# EAGLE design usbledv2 (EAGLE 5.06)
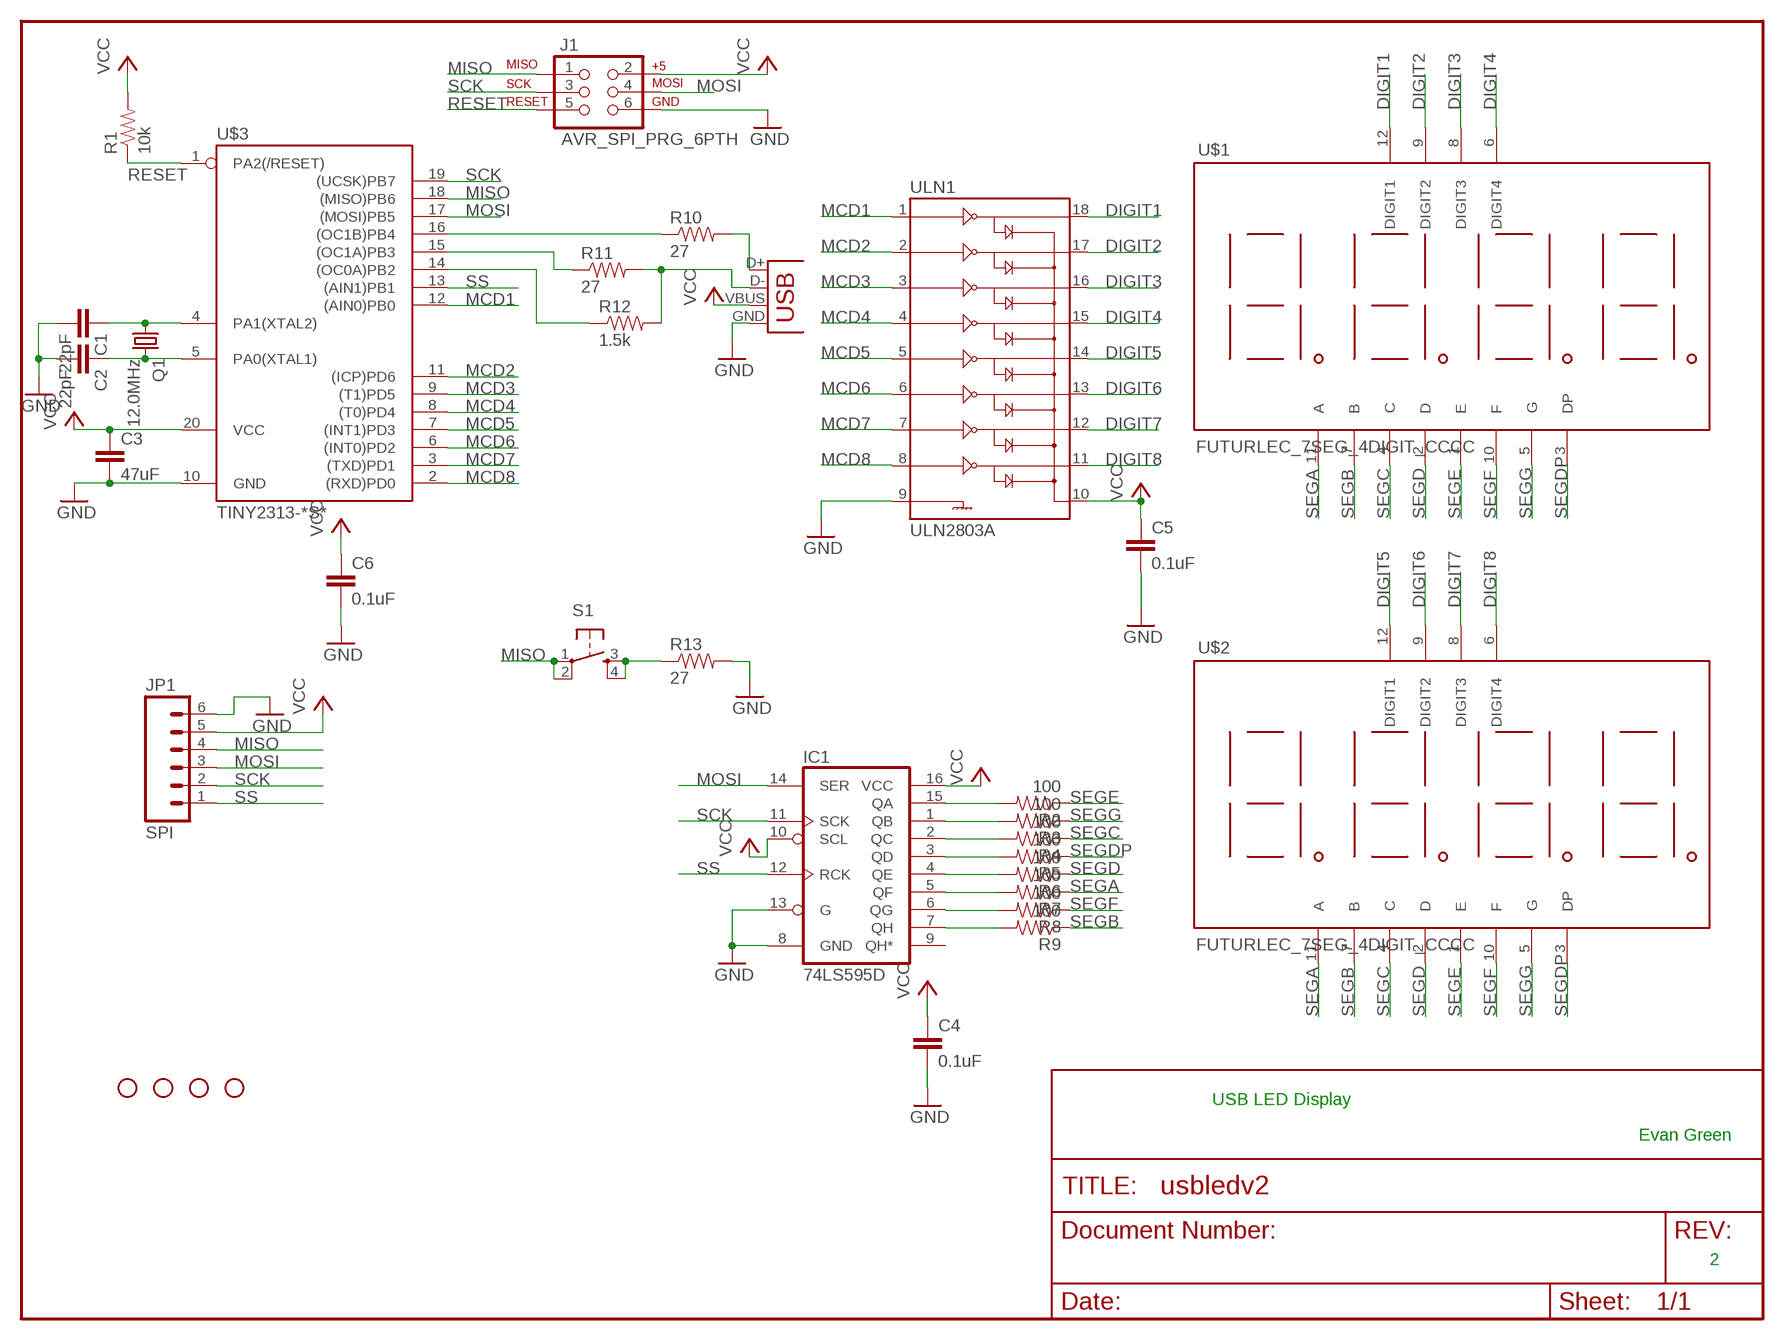
[diagram p0: schematic, sheet 1]

## Parts
C1  22pF  CAP0402-CAP  [0402-CAP]
C2  22pF  CAP0402-CAP  [0402-CAP]
C3  47uF  CAP1210  [1210]
C4  0.1uF  CAP0402-CAP  [0402-CAP]
C5  0.1uF  CAP0402-CAP  [0402-CAP]
C6  0.1uF  CAP0402-CAP  [0402-CAP]
IC1  74LS595D  [SO16]
J1  AVR_SPI_PRG_6PTH  [2X3]
JP1  SPI  M06SIP  [1X06]
JP2  STAND-OFF  [STAND-OFF]
JP3  STAND-OFF  [STAND-OFF]
JP4  STAND-OFF  [STAND-OFF]
JP5  STAND-OFF  [STAND-OFF]
Q1  12.0MHz  CRYSTALTC38H  [TC38H]
R1  10k  RESISTOR0402-RES  [0402-RES]
R2  100  RESISTOR0402-RES  [0402-RES]
R3  100  RESISTOR0402-RES  [0402-RES]
R4  100  RESISTOR0402-RES  [0402-RES]
R5  100  RESISTOR0402-RES  [0402-RES]
R6  100  RESISTOR0402-RES  [0402-RES]
R7  100  RESISTOR0402-RES  [0402-RES]
R8  100  RESISTOR0402-RES  [0402-RES]
R9  100  RESISTOR0402-RES  [0402-RES]
R10  27  RESISTOR0402-RES  [0402-RES]
R11  27  RESISTOR0402-RES  [0402-RES]
R12  1.5k  RESISTOR0402-RES  [0402-RES]
R13  27  RESISTOR0402-RES  [0402-RES]
S1  TAC_SWITCHSMD  [TACTILE_SWITCH_SMD]
U$1  FUTURLEC_7SEG_4DIGIT_CCCC  [FUTURLEC_7SEG_4DIGIT_CC]
U$2  FUTURLEC_7SEG_4DIGIT_CCCC  [FUTURLEC_7SEG_4DIGIT_CC]
U$3  TINY2313-*S*  [SO20L$]
ULN1  ULN2803A  ULN2803SOICW  [SO18L]
X1  USBSMD  [USB-MINIB]

## Nets
DIGIT1: U$1.12(DIGIT1) ULN1.18
DIGIT2: U$1.9(DIGIT2) ULN1.17
DIGIT3: U$1.8(DIGIT3) ULN1.16
DIGIT4: U$1.6(DIGIT4) ULN1.15
DIGIT5: U$2.12(DIGIT1) ULN1.14
DIGIT6: U$2.9(DIGIT2) ULN1.13
DIGIT7: U$2.8(DIGIT3) ULN1.12
DIGIT8: U$2.6(DIGIT4) ULN1.11
GND: C1.2 C2.2 C3.2 C4.2 C5.2 C6.2 IC1.8(GND) IC1.13(G) J1.6 JP1.6 R13.2 U$3.10(GND) ULN1.9 X1.GND
MCD1: U$3.12((AIN0)PB0) ULN1.1
MCD2: U$3.11((ICP)PD6) ULN1.2
MCD3: U$3.9((T1)PD5) ULN1.3
MCD4: U$3.8((T0)PD4) ULN1.4
MCD5: U$3.7((INT1)PD3) ULN1.5
MCD6: U$3.6((INT0)PD2) ULN1.6
MCD7: U$3.3((TXD)PD1) ULN1.7
MCD8: U$3.2((RXD)PD0) ULN1.8
MISO: J1.1 JP1.4 S1.1 S1.2 U$3.18((MISO)PB6)
MOSI: IC1.14(SER) J1.4 JP1.3 U$3.17((MOSI)PB5)
N$1: R11.1 U$3.15((OC1A)PB3)
N$2: C1.1 Q1.1 U$3.4(PA1(XTAL2))
N$3: C2.1 Q1.2 U$3.5(PA0(XTAL1))
N$4: R12.1 U$3.14((OC0A)PB2)
N$5: R13.1 S1.3 S1.4
N$11: R10.2 X1.D+
N$12: R10.1 U$3.16((OC1B)PB4)
N$13: R11.2 R12.2 X1.D-
N$32: IC1.15(QA) R2.2
N$33: IC1.1(QB) R3.2
N$34: IC1.2(QC) R4.2
N$35: IC1.3(QD) R5.2
N$36: IC1.4(QE) R6.2
N$37: IC1.5(QF) R7.2
N$38: IC1.6(QG) R8.2
N$39: IC1.7(QH) R9.2
RESET: J1.5 R1.1 U$3.1(PA2(/RESET))
SCK: IC1.11(SCK) J1.3 JP1.2 U$3.19((UCSK)PB7)
SEGA: R7.1 U$1.11(A) U$2.11(A)
SEGB: R9.1 U$1.7(B) U$2.7(B)
SEGC: R4.1 U$1.4(C) U$2.4(C)
SEGD: R6.1 U$1.2(D) U$2.2(D)
SEGDP: R5.1 U$1.3(DP) U$2.3(DP)
SEGE: R2.1 U$1.1(E) U$2.1(E)
SEGF: R8.1 U$1.10(F) U$2.10(F)
SEGG: R3.1 U$1.5(G) U$2.5(G)
SS: IC1.12(RCK) JP1.1 U$3.13((AIN1)PB1)
VCC: C3.1 C4.1 C5.1 C6.1 IC1.10(SCL) IC1.16(VCC) J1.2 JP1.5 R1.2 U$3.20(VCC) ULN1.10 X1.VBUS
Unconnected: IC1.9(QH*)

## Notes on the sheet
- USB LED Display
- Evan Green
- 2

## Library data of the parts
C1-C6 = SparkFun:CAP: Capacitor Standard 0603 ceramic capacitor, and 0.1" leaded capacitor.
IC1 = SparkFun:74*595: 8-bit SHIFT REGISTER, output latch
J1 = SparkFun:AVR_SPI_PRG_6: AVR ISP 6 Pin This is the reduced ISP connector for AVR programming. Common on Arduino. This footprint will take up less PCB space and can be used with a 10-pin to 6-pin adapter such as SKU: BOB-08508
JP1 = SparkFun:M06: Header 6 Standard 6-pin 0.1" header. Use with straight break away headers (SKU : PRT-00116), right angle break away headers (PRT-00553), swiss pins (PRT-00743), machine pins (PRT-00117), and female headers (PRT-00115). Molex polarized connector foot print use with SKU : PRT-08094 with associated crimp pins and housings. NOTES ON THE VARIANTS LOCK and LOCK_LONGPADS... This footprint was designed to help hold the alignment of a through-hole component (i.e. 6-pin header) while soldering it into place. You may notice that each hole has been shifted either up or down by 0.005 of an inch from it's more standard position (which is a perfectly straight line). This slight alteration caused the pins (the squares in the middle) to touch the edges of the holes. Because they are alternating, it causes a "brace" to hold the component in place. 0.005 has proven to be the perfect amount of "off-center" position when using our standard breakaway headers. Although looks a little odd when you look at the bare footprint, once you have a header in there, the alteration is very hard to notice. Also, if you push a header all the way into place, it is covered up entirely on the bottom side. This idea of altering the position of holes to aid alignment will be further integrated into the Sparkfun Library for other footprints. It can help hold any component with 3 or more connection pins.
JP2-JP5 = SparkFun:STAND-OFF: Stand Off This is the mechanical footprint for a #4 phillips button head screw. Use the keepout ring to avoid running the screw head into surrounding components. SKU : PRT-00447
Q1 = SparkFun:CRYSTAL: Crystals Various standard crystals. Proven footprints. Spark Fun Electronics SKU : COM-00534
R1-R13 = SparkFun:RESISTOR: Resistor Basic schematic elements and footprints for 0603, 1206, and PTH 1/10th watt (small) resistors.
S1 = SparkFun:TAC_SWITCH: Momentary Switch Button commonly used for reset or general input. Spark Fun Electronics SKU : COM-00097
U$1 U$2 = Evan:FUTURLEC_7SEG_4DIGIT_CC: 4-Digit 7-Segment LED Display from Futurlec: 7FR5641AS, 7FG5641AG, 7FY5641AY, 7FB5641AB, 7FW5641AW.
U$3 = avr-6:TINY2313*: Atmel Tiny2313 2K Flash, 128 bytes EEPROM, 128 bytes RAM
ULN1 = SparkFun:ULN2803: Darlington Driver ULN2803 Darlington array. 500mA max per channel, 8-channel package. Spark Fun Electronics SKU : COM-00312
X1 = SparkFun:USB: USB Connectors USB-B-PTH is fully proven SKU : PRT-00139 USB-miniB is fully proven SKU : PRT-00587 USB-A-PCB is untested. USB-A-H is throughly reviewed, but untested. Spark Fun Electronics SKU : PRT-00437 USB-B-SMT is throughly reviewed, but untested. Needs silkscreen touching up. USB-A-S has not been used/tested USB-MB-H has not been used/tested

## Net classes
0 default: width 0.406 mm

## Board
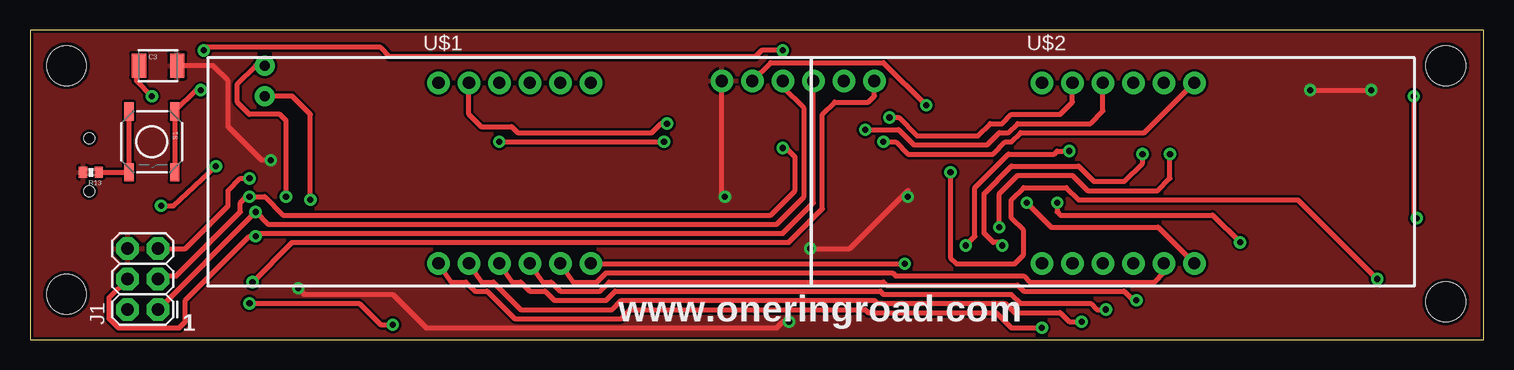
[diagram p1: board, top side]
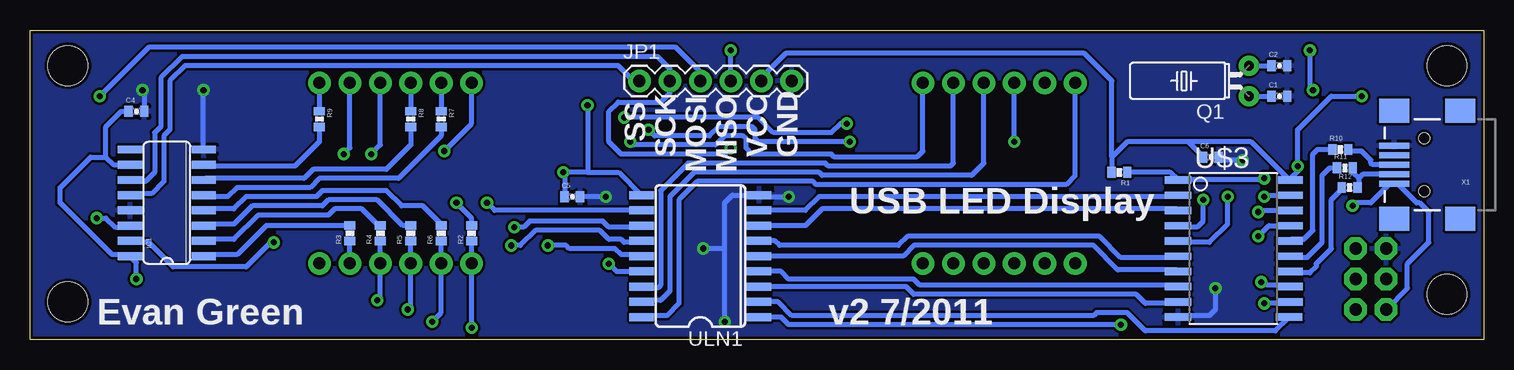
[diagram p2: board, bottom side, seen from below]

Size 121.14 x 25.83 mm. Coordinates in mm from the lower left corner, seen from the top.
Outline: 0,0 121.14,0 121.14,25.83 0,25.83 0,0
Copper layers (1*16): Top 0.035mm / dielectric 1.5mm / Bottom 0.035mm
Design rules "SparkFun": minimum track width 8mil, minimum drill 20mil, track to track 8mil, track to pad 8mil, pad to pad 8mil, via to via 8mil, smd to smd 8mil, copper to edge 10mil, drill to drill 8mil, minimum pad ring 12mil, minimum via ring 10mil, stop-mask expansion 4mil, vias tented up to drill 25mil, thermal gap 10mil

### Footprints (pad centres in the part's own frame; a part is rotated, then mirrored left to right if it is on the bottom)
0402-CAP = smd 0.7 x 0.9: 1 -0.65,0; 2 0.65,0
1210 = smd 1.2 x 2: 1 -1.6,0; 2 1.6,0
SO16 = smd 0.66 x 2.032: 1 -4.445,-3.073; 2 -3.175,-3.073; 3 -1.905,-3.073; 4 -0.635,-3.073; 5 0.635,-3.073; 6 1.905,-3.073; 7 3.175,-3.073; 8 4.445,-3.073; 9 4.445,3.073; 10 3.175,3.073; 11 1.905,3.073; 12 0.635,3.073; 13 -0.635,3.073; 14 -1.905,3.073; 15 -3.175,3.073; 16 -4.445,3.073
2X3 = drill 1.016 pad 1.88 octagon: 1 0,0; 2 0,2.54; 3 2.54,0; 4 2.54,2.54; 5 5.08,0; 6 5.08,2.54
1X06 = drill 1.016 pad 1.88 round: 1 0,0; 2 2.54,0; 3 5.08,0; 4 7.62,0; 5 10.16,0; 6 12.7,0
STAND-OFF = hole 3.302: 0,0
TC38H = drill 0.813 pad 1.676 round: 1 -1.27,0; 2 1.27,0
0402-RES = smd 0.7 x 0.9: 1 -0.65,0; 2 0.65,0
TACTILE_SWITCH_SMD = smd 1.524 x 0.762: 1 -2.54,1.905; 2 2.54,1.905; 3 -2.54,-1.905; 4 2.54,-1.905
FUTURLEC_7SEG_4DIGIT_CC = drill 1.016 pad 1.88 round: 1 -6.35,-7.58; 2 -3.81,-7.58; 3 -1.27,-7.58; 4 1.27,-7.58; 5 3.81,-7.58; 6 6.35,-7.58; 7 6.35,7.46; 8 3.81,7.46; 9 1.27,7.46; 10 -1.27,7.46; 11 -3.81,7.46; 12 -6.35,7.46
SO20L$ = smd 0.61 x 2.21: 1 -5.715,-4.636; 2 -4.445,-4.636; 3 -3.175,-4.636; 4 -1.905,-4.636; 5 -0.635,-4.636; 6 0.635,-4.636; 7 1.905,-4.636; 8 3.175,-4.636; 9 4.445,-4.636; 10 5.715,-4.636; 11 5.715,4.61; 12 4.445,4.636; 13 3.175,4.636; 14 1.905,4.636; 15 0.635,4.636; 16 -0.635,4.636; 17 -1.905,4.636; 18 -3.175,4.636; 19 -4.445,4.636; 20 -5.715,4.636
SO18L = smd 0.66 x 2.032: 1 -0.635,-4.902; 2 0.635,-4.902; 3 1.905,-4.902; 4 3.175,-4.902; 5 4.445,-4.902; 6 5.715,-4.902; 7 6.985,-4.902; 8 8.255,-4.902; 9 9.525,-4.902; 10 9.525,4.902; 11 8.255,4.902; 12 6.985,4.902; 13 5.715,4.902; 14 4.445,4.902; 15 3.175,4.902; 16 1.905,4.902; 17 0.635,4.902; 18 -0.635,4.902
USB-MINIB = smd 2.5 x 0.5: D+ 2.5,0; D- 2.5,0.8; GND 2.5,-1.6; ID 2.5,-0.8; VBUS 2.5,1.6 | smd 2.5 x 2: GND@1 -3,-4.5; GND@2 -3,4.5; GND@3 2.5,4.5; GND@4 2.5,-4.5 | hole 0.9: 0,2.2; 0,-2.2

### Placement (x,y rotation side)
C1  17.02,20.32 0 bottom
C2  17.02,22.86 0 bottom
C3  10.67,22.86 0 top
C4  112.27,19.05 0 bottom
C5  75.95,11.94 0 bottom
C6  22.73,15.24 0 bottom
IC1  109.73,11.43 90 bottom
J1  10.67,2.54 90 top
JP1  70.36,21.59 0 bottom
JP2  3.05,22.86 0 top
JP3  3.05,3.81 0 top
JP4  117.98,22.86 0 top
JP5  117.98,3.17 0 top
Q1  19.56,21.59 90 bottom
R1  30.35,13.97 180 bottom
R2  84.33,8.89 90 bottom
R3  94.49,8.89 90 bottom
R4  91.95,8.89 90 bottom
R5  89.41,8.89 90 bottom
R6  86.87,8.89 90 bottom
R7  86.87,18.41 270 bottom
R8  89.41,18.41 270 bottom
R9  97.03,18.41 270 bottom
R10  11.94,15.88 0 bottom
R11  11.56,14.35 0 bottom
R12  11.18,12.7 0 bottom
R13  5.08,13.97 180 top
S1  10.16,16.51 270 top
U$1  40.39,13.97 0 top
U$2  90.68,13.97 0 top
U$3  20.83,7.62 270 bottom
ULN1  65.28,2.54 90 bottom
X1  4.95,14.61 180 bottom

### Tracks (layer width: path | path; a pad name or v marks a point on that pad's centre or on a via)
DIGIT1
  Bottom 0.406: ULN1.18 70.05,2.03 68.07,2.03 67.06,3.05 67.06,11.68 65.53,13.21 55.88,13.21 55.63,12.95 34.8,12.95 34.04,13.72 U$1.12
DIGIT2
  Bottom 0.406: ULN1.17 70.05,3.3 68.58,3.3 67.82,4.06 67.82,11.94 65.79,13.97 55.37,13.97 55.12,13.72 42.67,13.72 41.66,14.73 U$1.9
DIGIT3
  Bottom 0.406: ULN1.16 70.05,4.32 68.83,4.32 68.58,4.57 68.58,12.45 66.29,14.73 54.86,14.73 54.61,14.48 44.45,14.48 44.2,14.73 U$1.8
DIGIT4  (via drill 0.51)
  Top 0.406: U$1.6 46.27,6.35 v72.9,6.35
  Bottom 0.406: v72.9,6.35 72.26,5.71 ULN1.15
DIGIT5  (via drill 0.51)
  Top 0.406: v77.98,7.87 78.74,8.64 78.74,12.7 81.53,15.49 85.34,15.49 85.6,15.75 v86.61,15.75
  Bottom 0.406: ULN1.14 70.31,7.11 71.88,7.11 72.39,7.62 76.2,7.62 76.45,7.87 v77.98,7.87 | v86.61,15.75 84.33,18.03 U$2.12
DIGIT6  (via drill 0.51)
  Top 0.406: v81.03,7.87 80.77,8.13 80.26,8.13 79.5,8.89 79.5,12.19 81.79,14.48 87.38,14.48 88.65,13.21 91.19,13.21 92.71,14.73 v92.71,15.49
  Bottom 0.406: ULN1.13 70.31,8.13 71.63,8.13 71.88,8.38 72.9,8.38 73.66,9.14 78.99,9.14 80.26,7.87 v81.03,7.87 | v92.71,15.49 91.95,16.26 U$2.9
DIGIT7  (via drill 0.51)
  Top 0.406: v80.77,9.4 80.77,12.19 82.3,13.72 86.87,13.72 88.14,12.45 93.98,12.45 95,13.46 v95,15.49
  Bottom 0.406: ULN1.12 70.31,9.4 72.9,9.4 73.41,9.91 79.5,9.91 80.01,9.4 v80.77,9.4 | v95,15.49 94.49,16 U$2.8
DIGIT8  (via drill 0.51)
  Top 0.406: U$2.6 94.02,9.4 85.09,9.4 v83.06,11.43
  Bottom 0.406: v83.06,11.43 82.42,10.79 ULN1.11
GND  (via drill 0.51)
  Top 0.406: C3.2 12.27,22.78 12.34,22.86 15.24,22.86 16.51,21.59 16.51,17.78 19.3,14.99 v20.07,14.99 | v57.91,11.94 57.66,12.19 JP1.6 | v73.15,11.94 73.15,12.45 68.33,7.62 v65.02,7.62 | v106.68,20.83 v111.76,20.83 | v22.35,4.32 22.86,3.81 30.23,3.81 33.02,1.02 62.23,1.02 62.74,1.52 v63.25,1.52
  Bottom 0.406: C6.2 21.83,14.99 v20.07,14.99 | v57.91,11.94 60.25,11.94 ULN1.9 62.61,12.06 63.25,11.43 63.25,7.62 | v73.15,11.94 C5.2 | IC1.8 106.68,15.9 v106.68,20.83 | v111.76,20.83 111.62,20.69 C4.2 | U$3.10 25.34,2.03 22.86,2.03 22.35,2.54 v22.35,4.32 | v63.25,1.52 63.25,7.62 | 63.25,7.62 v65.02,7.62
  pour Top: 0,0 121.16,0 121.16,25.91 0,25.91
  pour Bottom: 0,0 121.16,0 121.16,25.91 0,25.91
MCD1  (via drill 0.51)
  Top 0.406: v18.29,3.05 27.43,3.05 29.21,1.27 v30.23,1.27
  Bottom 0.406: U$3.12 16.32,3.05 v18.29,3.05 | v30.23,1.27 57.91,1.27 58.55,1.91 ULN1.1
MCD2
  Bottom 0.406: U$3.11 17.36,0.76 28.19,0.76 29.72,2.29 32.26,2.29 32.51,2.03 57.66,2.03 58.8,3.17 ULN1.2
MCD3
  Bottom 0.406: U$3.9 25.59,3.05 28.19,3.05 28.96,3.81 47.5,3.81 48.13,4.45 ULN1.3
MCD4
  Bottom 0.406: U$3.8 25.59,4.57 46.99,4.57 47.5,5.08 57.91,5.08 58.55,5.71 ULN1.4
MCD5
  Bottom 0.406: U$3.7 25.59,5.84 30.48,5.84 32.51,7.87 47.5,7.87 48.39,6.99 ULN1.5
MCD6
  Bottom 0.406: U$3.6 25.59,6.86 30.23,6.86 32,8.64 48.01,8.64 48.77,7.87 58.67,7.87 59.05,8.26 ULN1.6
MCD7
  Bottom 0.406: U$3.3 25.59,10.92 55.12,10.92 56.52,9.53 ULN1.7
MCD8
  Bottom 0.406: U$3.2 25.59,11.94 55.37,11.94 56.52,10.79 ULN1.8
MISO  (via drill 0.51)
  Top 0.406: J1.1 v18.8,10.67 19.81,9.65 62.23,9.65 64.52,11.94 64.52,19.3 62.74,21.08 JP1.4 | S1.2 S1.1 13.84,20.83 v14.22,20.83 | v14.48,24.13 14.73,24.38 29.21,24.38 29.97,23.62 60.45,23.62 60.96,24.13 v62.74,24.13
  Bottom 0.406: v18.8,10.67 18.67,10.79 U$3.18 | v14.22,20.83 14.48,21.08 v14.48,24.13 | JP1.4 v62.74,24.13
MOSI  (via drill 0.51)
  Top 0.406: J1.4 6.6,3.56 6.6,1.78 7.37,1.02 12.45,1.02 12.95,1.52 12.95,3.3 18.29,8.64 v18.8,8.64 19.05,8.89 62.74,8.89 65.28,11.43 JP1.3 | v115.57,10.16 115.32,10.41 v115.32,20.32
  Bottom 0.406: v18.8,8.64 17.91,9.53 U$3.17 | IC1.14 112.93,9.4 114.05,9.4 114.81,10.16 v115.57,10.16 | v115.32,20.32 111.25,24.38 67.31,24.38 65.28,22.35 JP1.3
N$1
  Bottom 0.406: U$3.15 16.07,6.86 14.73,6.86 13.46,8.13 13.46,13.72 12.83,14.35 R11.1
N$2  (via drill 0.51)
  Top 0.406: v23.37,11.68 23.37,18.8 21.84,20.32 Q1.1
  Bottom 0.406: U$3.4 25.34,9.4 23.88,9.4 23.37,9.91 v23.37,11.68 | Q1.1 C1.1
N$3  (via drill 0.51)
  Top 0.406: v21.34,11.94 21.34,18.29 20.83,18.8 18.29,18.8 17.27,19.81 17.27,21.34 18.8,22.86 Q1.2
  Bottom 0.406: U$3.5 25.34,8.13 22.86,8.13 21.34,9.65 v21.34,11.94 | Q1.2 C2.1
N$4
  Bottom 0.406: U$3.14 16.07,5.59 14.48,5.59 13.97,6.1 13.97,6.35 12.7,7.62 12.7,11.68 11.83,12.56 R12.1
N$5
  Top 0.406: S1.3 S1.4 R13.1
N$11
  Bottom 0.406: R10.2 11.16,15.75 10.16,15.75 9.4,14.99 9.4,14.73 9.27,14.61 X1.D+
N$12
  Bottom 0.406: U$3.16 16.07,8.38 14.99,8.38 14.22,9.14 14.22,15.49 13.84,15.88 R10.1
N$13
  Bottom 0.406: R12.2 10.41,12.81 10.41,13.46 | 10.41,13.46 10.91,13.96 R11.2 | 10.41,13.46 10.07,13.8 X1.D-
N$32  (via drill 0.51)
  Top 0.406: v100.84,8.13 98.55,10.41 85.85,10.41 85.6,10.67 v85.6,11.43
  Bottom 0.406: IC1.15 112.67,8.13 111.25,8.13 109.22,6.1 103.12,6.1 101.09,8.13 v100.84,8.13 | v85.6,11.43 84.33,10.16 R2.2
N$33
  Bottom 0.406: IC1.1 106.53,7.11 103.89,7.11 101.46,9.54 R3.2
N$34
  Bottom 0.406: IC1.2 106.53,8.38 104.14,8.38 102.11,10.41 96.27,10.41 95.76,10.92 93.47,10.92 92.09,9.54 R4.2
N$35
  Bottom 0.406: IC1.3 106.53,9.65 104.14,9.65 102.62,11.18 96.77,11.18 96.27,11.68 92.2,11.68 90.06,9.54 R5.2
N$36
  Bottom 0.406: IC1.4 106.53,10.92 104.14,10.92 103.12,11.94 97.28,11.94 96.77,12.45 91.44,12.45 90.17,11.18 88.39,11.18 86.87,9.65 R6.2
N$37
  Bottom 0.406: IC1.5 106.53,11.94 104.65,11.94 103.89,12.7 97.79,12.7 97.03,13.46 90.42,13.46 86.87,17.02 R7.2
N$38
  Bottom 0.406: IC1.6 106.53,13.46 98.3,13.46 97.54,14.22 91.44,14.22 89.41,16.26 R8.2
N$39
  Bottom 0.406: IC1.7 106.53,14.48 99.06,14.48 97.03,16.51 R9.2
RESET  (via drill 0.51)
  Top 0.406: J1.5 12.95,7.62 16.51,11.18 16.51,12.45 17.53,13.46 v18.29,13.46
  Bottom 0.406: v18.29,13.46 18.41,13.34 U$3.1 26.1,13.97 R1.1
SCK  (via drill 0.51)
  Top 0.406: J1.3 10.92,5.33 12.19,5.33 17.53,10.67 17.53,11.43 18.03,11.94 v18.29,11.94 19.56,11.94 21.08,10.41 61.72,10.41 63.75,12.45 63.75,15.24 62.99,16 v62.74,16
  Bottom 0.406: v18.29,11.94 18.16,12.06 U$3.19 | IC1.11 112.67,13.21 111.51,13.21 110.74,13.97 110.74,17.27 110.24,17.78 110.24,21.84 108.46,23.62 68.83,23.62 67.82,22.61 JP1.2 67.82,20.57 68.58,19.81 72.14,19.81 72.9,19.05 72.9,16.51 71.88,15.49 63.25,15.49 v62.74,16
SEGA  (via drill 0.51)
  Top 0.406: U$2.11 86.87,19.81 85.85,18.8 81.79,18.8 81.03,18.03 80.01,18.03 78.99,17.02 73.91,17.02 72.39,18.54 v71.63,18.54 | v53.09,18.03 52.58,18.03 51.82,17.27 40.64,17.27 40.13,17.78 37.59,17.78 36.58,18.8 U$1.11
  Bottom 0.406: v71.63,18.54 60.45,18.54 59.18,17.27 54.36,17.27 53.59,18.03 v53.09,18.03 | U$2.11 R7.1
SEGB  (via drill 0.51)
  Top 0.406: U$2.7 92.87,17.27 82.55,17.27 81.79,16.51 81.28,16.51 80.26,15.49 73.15,15.49 72.14,16.51 v71.12,16.51
  Bottom 0.406: U$2.7 R9.1 | v71.12,16.51 70.87,16.26 64.01,16.26 63.25,17.02 61.72,17.02 61.47,16.76 61.47,16 60.96,15.49 54.36,15.49 54.1,15.24 47.24,15.24 46.74,15.75 U$1.7
SEGC  (via drill 0.51)
  Top 0.406: U$1.4 42.71,4.83 43.43,4.83 44.2,4.06 47.5,4.06 48.26,4.83 71.12,4.83 71.37,4.57 82.3,4.57 82.8,4.06 91.19,4.06 91.95,3.3 v92.2,3.3
  Bottom 0.406: v92.2,3.3 91.95,3.56 U$2.4 R4.1
SEGD  (via drill 0.51)
  Top 0.406: U$1.2 37.63,4.83 38.61,4.83 40.89,2.54 48.51,2.54 49.28,3.3 70.36,3.3 70.61,3.05 81.28,3.05 82.04,2.29 85.85,2.29 86.61,1.52 v87.63,1.52
  Bottom 0.406: v87.63,1.52 86.87,2.29 U$2.2 R6.1
SEGDP  (via drill 0.51)
  Top 0.406: U$1.3 40.17,4.83 40.89,4.83 41.66,4.06 42.93,4.06 43.69,3.3 48.01,3.3 48.77,4.06 70.87,4.06 71.12,3.81 81.79,3.81 82.55,3.05 88.39,3.05 88.9,2.54 v89.66,2.54
  Bottom 0.406: v89.66,2.54 89.41,2.79 U$2.3 R5.1
SEGE  (via drill 0.51)
  Top 0.406: U$1.1 35.09,4.83 36.32,4.83 37.08,4.06 38.1,4.06 40.39,1.78 49.28,1.78 50.04,2.54 69.6,2.54 69.85,2.29 80.52,2.29 81.79,1.02 v84.33,1.02
  Bottom 0.406: v84.33,1.02 U$2.1 R2.1
SEGF  (via drill 0.51)
  Top 0.406: U$2.10 R8.1 88.38,18.03 82.3,18.03 81.53,17.27 80.77,17.27 79.76,16.26 73.66,16.26 72.39,17.53 v69.6,17.53 | v39.12,16.51 v52.83,16.51
  Bottom 0.406: v69.6,17.53 69.09,17.02 64.52,17.02 63.75,17.78 60.96,17.78 60.71,17.53 60.71,16.76 60.45,16.51 v52.83,16.51 | v39.12,16.51 U$1.10 | U$2.10 R8.1
SEGG
  Top 0.406: U$1.5 45.25,4.83 47.24,4.83 48.01,5.59 71.88,5.59 72.14,5.33 82.8,5.33 83.31,4.83 93.73,4.83 94.49,5.59 U$2.5
  Bottom 0.406: U$2.5 R3.1
SS  (via drill 0.51)
  Top 0.406: v18.54,4.83 21.84,8.13 63.25,8.13 66.04,10.92 66.04,18.8 67.06,19.81 69.85,19.81 70.36,20.32 JP1.1
  Bottom 0.406: IC1.12 112.67,12.19 111,12.19 109.98,13.21 109.98,17.02 109.47,17.53 109.47,21.59 108.2,22.86 72.14,22.86 70.87,21.59 JP1.1 | U$3.13 16.32,4.57 18.03,4.57 18.29,4.83 v18.54,4.83
VCC  (via drill 0.51)
  Top 0.406: v15.49,14.48 11.94,11.18 v10.92,11.18 | v112.27,5.08 105.66,11.68 87.38,11.68 86.36,12.7 82.8,12.7 81.79,11.68 81.79,10.16 82.8,9.14 82.8,7.11 82.04,6.35 77.22,6.35 76.71,6.86 v76.71,13.97 | JP1.5 61.72,23.11 71.12,23.11 v74.68,19.56 | C3.1 8.89,22.68 8.89,21.59 v10.16,20.32
  Bottom 0.406: v10.92,11.18 10.67,11.43 9.4,11.43 7.82,13.01 X1.VBUS 7.16,13.01 5.59,11.43 5.33,11.43 4.57,10.67 4.57,8.13 6.35,6.35 6.35,4.32 J1.2 | C4.1 113.54,19.05 114.81,17.78 114.81,15.24 | 114.81,15.24 114.17,14.61 IC1.10 | 114.81,15.24 116.08,15.24 118.62,12.7 118.62,11.43 114.3,7.11 112.93,7.11 IC1.16 112.27,6.45 v112.27,5.08 | v74.68,19.56 74.68,13.97 | C5.1 76.6,13.86 v76.71,13.97 74.68,13.97 | R1.2 30.99,13.98 30.99,15.24 | 30.99,15.24 29.72,16.51 24.64,16.51 | 24.64,16.51 23.38,15.26 C6.1 | 24.64,16.51 19.37,16.51 U$3.20 15.3,14.22 v15.49,14.48 15.49,17.53 12.7,20.32 v10.16,20.32 | 30.99,15.24 30.99,21.59 33.27,23.88 58.17,23.88 60.2,21.84 JP1.5 | ULN1.10 72.08,13.97 74.68,13.97

### Text on the board
tPlace: www.oneringroad.com | 1
bPlace: SS | GND | VCC | SCK | MISO | MOSI | USB LED Display | v2 7/2011 | Evan Green